# EAGLE schematic Filla_GPS_2015 (EAGLE 7.4.0)
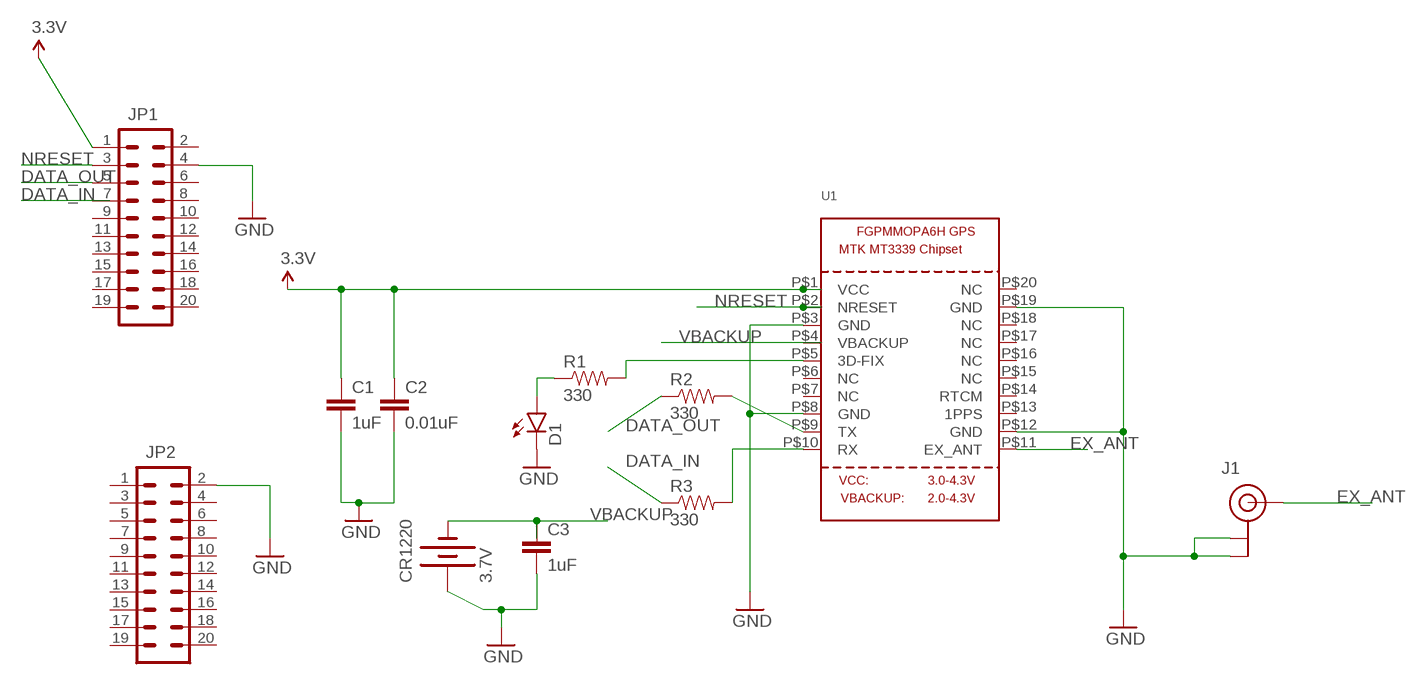
[diagram p0: schematic, sheet 1]

## Parts
C1  1uF  CAP1206  [1206]
C2  0.01uF  CAP1206  [1206]
C3  1uF  CAP1206  [1206]
CR1220  3.7V  BATTERY12MM  [BATTCON_12MM]
D1  LED1206  [LED-1206]
J1  U.FL  [U.FL]
JP1  M10X2  [2X10]
JP2  M10X2  [2X10]
R1  330  RESISTOR1206  [1206]
R2  330  RESISTOR1206  [1206]
R3  330  RESISTOR1206  [1206]
U1  GPS_FGPMMOPA6H  [FGPMMOPA6H]

## Nets
3.3V: C1.1 C2.1 JP1.1 U1.P$1(VCC)
DATA_IN: R3.1
DATA_OUT: JP1.5 R2.1
EX_ANT: J1.P$3(SIGNAL) U1.P$11(EX_ANT)
GND: C1.2 C2.2 C3.2 CR1220.PWR@1(+) D1.C J1.P$1(GND) J1.P$2(GND) JP1.4 JP2.2 U1.P$3(GND) U1.P$8(GND) U1.P$12(GND) U1.P$19(GND)
N$1: R2.2 U1.P$9(TX)
N$2: R1.2 U1.P$5(3D-FIX)
N$3: D1.A R1.1
N$4: R3.2 U1.P$10(RX)
NRESET: JP1.3 U1.P$2(NRESET)
VBACKUP: C3.1 CR1220.GND(-)
Unconnected: JP1.2 JP1.6 JP1.7 JP1.8 JP1.9 JP1.10 JP1.11 JP1.12 JP1.13 JP1.14 JP1.15 JP1.16 JP1.17 JP1.18 JP1.19 JP1.20 JP2.1 JP2.3 JP2.4 JP2.5 JP2.6 JP2.7 JP2.8 JP2.9 JP2.10 JP2.11 JP2.12 JP2.13 JP2.14 JP2.15 JP2.16 JP2.17 JP2.18 JP2.19 JP2.20 U1.P$4(VBACKUP) U1.P$6(NC) U1.P$7(NC) U1.P$13(1PPS) U1.P$14(RTCM) U1.P$15(NC) U1.P$16(NC) U1.P$17(NC) U1.P$18(NC) U1.P$20(NC)

## Library data of the parts
C1-C3 = SparkFun-Capacitors:CAP: Capacitor Standard 0603 ceramic capacitor, and 0.1" leaded capacitor.
CR1220 = SparkFun-Electromechanical:BATTERY: Battery Holders Various common sizes : AA, AAA, 18650 (PRT-12895), 20mm coin cell and 12mm coin cell. 20MM_4LEGS, BATT-10373; PROD_ID: BATT-08044
D1 = SparkFun-LED:LED: LEDs Standard schematic elements and footprints for 5mm, 3mm, 1206, and 0603 sized LEDs. 5mm - Spark Fun Electronics SKU : COM-00529 (and others)
J1 = SparkFun-Connectors:U.FL: SMD antenna connector- WRL-09144; PROD_ID: CONN-09193
JP1 JP2 = SparkFun-Connectors:M10X2: This was SPECIALLY designed to be used with our Graphic LCD Backpack. Be sure you want to use this! It is not only staggered on each line of header holes, but IT IS ALSO offset of the center point of the top and bottom lines by 5 mil. This causes the headers to lock into place on the "standard" footprint on the LCD screen. The extra squares on the tdocu layer are there simply to reference other pins (if you were to actually populate a longer header than ten long - this is what we do with the backpacks).
R1-R3 = SparkFun-Resistors:RESISTOR: Resistor Basic schematic elements and footprints for 0603, 1206, and PTH resistors.
U1 = adafruit:GPS_FGPMMOPA6H: GPS Module - MTK MT3339 Chipset, -165dBm sensitivity, 22 channels, 10Hz, auto-select external antenna options